# Altium schematic sheet MACH_VXL.SchDoc
size A
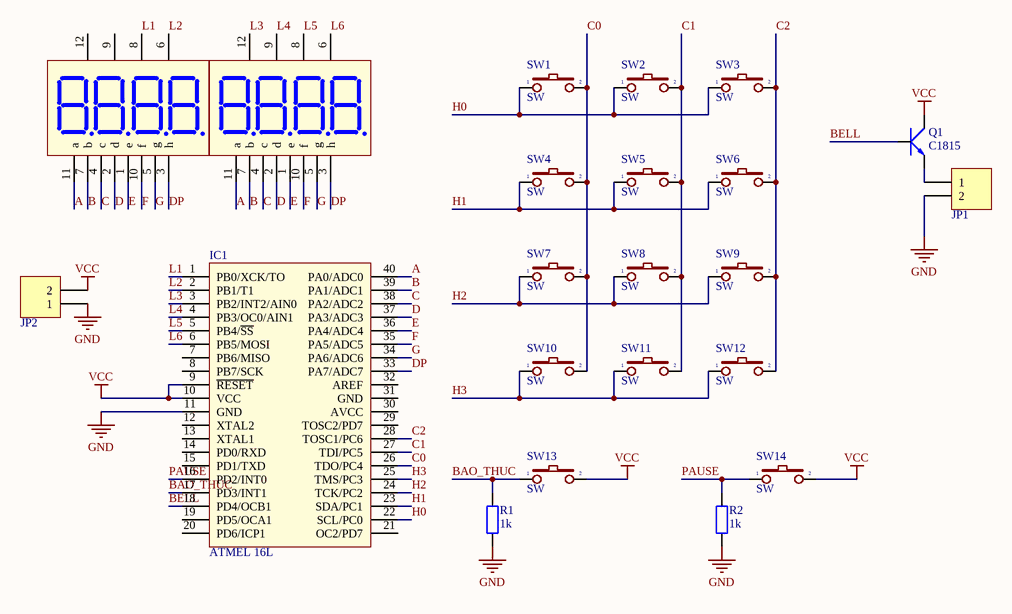
[diagram p0: MACH_VXL.SchDoc]

## Parts
D1  (no value)  [LED7SEG-4-0.36]
D2  (no value)  [LED7SEG-4-0.36]
IC1  ATMEL 16L  [DIP40/W0.6]
JP1  Header 2_1  [HED2]  (value not drawn)
JP2  Header 2_1  [HED2]  (value not drawn)
Q1  C1815  [QTO-92]
R1  1k  [R1/4W]
R2  1k  [R1/4W]
SW1  SW  [SW2]
SW2  SW  [SW2]
SW3  SW  [SW2]
SW4  SW  [SW2]
SW5  SW  [SW2]
SW6  SW  [SW2]
SW7  SW  [SW2]
SW8  SW  [SW2]
SW9  SW  [SW2]
SW10  SW  [SW2]
SW11  SW  [SW2]
SW12  SW  [SW2]
SW13  SW  [SW2]
SW14  SW  [SW2]

## Nets
GND: IC1.11(GND) JP1.2 JP2.1 R1.1 R2.1
VCC: IC1.9(~{RESET}) IC1.10(VCC) JP2.2 Q1.2(C) SW13.2 SW14.2
A: D1.11(a) D2.11(a) IC1.40(PA0/ADC0)
B: D1.7(b) D2.7(b) IC1.39(PA1/ADC1)
BAO_THUC: IC1.17(PD3/INT1) R1.2 SW13.1
BELL: IC1.18(PD4/OCB1) Q1.3(B)
C: D1.4(c) D2.4(c) IC1.38(PA2/ADC2)
C0: IC1.26(TDO/PC4) SW1.2 SW4.2 SW7.2 SW10.2
C1: IC1.27(TDI/PC5) SW2.2 SW5.2 SW8.2 SW11.2
C2: IC1.28(TOSC1/PC6) SW3.2 SW6.2 SW9.2 SW12.2
D: D1.2(d) D2.2(d) IC1.37(PA3/ADC3)
DP: D1.3(h) D2.3(h) IC1.33(PA7/ADC7)
E: D1.1(e) D2.1(e) IC1.36(PA4/ADC4)
F: D1.10(f) D2.10(f) IC1.35(PA5/ADC5)
G: D1.5(g) D2.5(g) IC1.34(PA6/ADC6)
H0: IC1.22(SCL/PC0) SW1.1 SW2.1 SW3.1
H1: IC1.23(SDA/PC1) SW4.1 SW5.1 SW6.1
H2: IC1.24(TCK/PC2) SW7.1 SW8.1 SW9.1
H3: IC1.25(TMS/PC3) SW10.1 SW11.1 SW12.1
L1: D1.8(V3) IC1.1(PB0/XCK/TO)
L2: D1.6(V4) IC1.2(PB1/T1)
L3: D2.12(V1) IC1.3(PB2/INT2/AIN0)
L4: D2.9(V2) IC1.4(PB3/OC0/AIN1)
L5: D2.8(V3) IC1.5(PB4/~{SS})
L6: D2.6(V4) IC1.6(PB5/MOSI)
PAUSE: IC1.16(PD2/INT0) R2.2 SW14.1
NetJP1_1: JP1.1 Q1.1(E)

Not connected (* = marked no-connect by the designer): D1 9(V2) 12(V1); IC1 7(PB6/MISO) 8(PB7/SCK) 12(XTAL2) 13(XTAL1) 14(PD0/RXD) 15(PD1/TXD) 19(PD5/OCA1) 20(PD6/ICP1) 21(OC2/PD7) 29(TOSC2/PD7) 30(AVCC) 31(GND) 32(AREF)

## Library data of the parts
D1 D2 = LED7SEG-A-0.36-4DIGIT: 4 digit 7 segment anot; Solder: WAVE; Category: LED
IC1 = Atmega16L: 8-Bit AVR Microcontroller with 16K Bytes of In-System Programmable Flash Memory; Value: Atmega 16L
JP1 JP2 = Header 2_1: Header, 2-Pin; Manufacturer: Generic Components; Class: Connector; Value: Header 2
Q1 = C1815: NPN 600mW, ECB; Value: C1815
R1 R2 = R1/4W: Resistor 1/4W; Value: R1/4W - 1K
SW1-SW14 = SW2: Switch button 2 pin; Value: SW chip 2 pin